# Altium schematic sheet Schematic.SchDoc
size A4
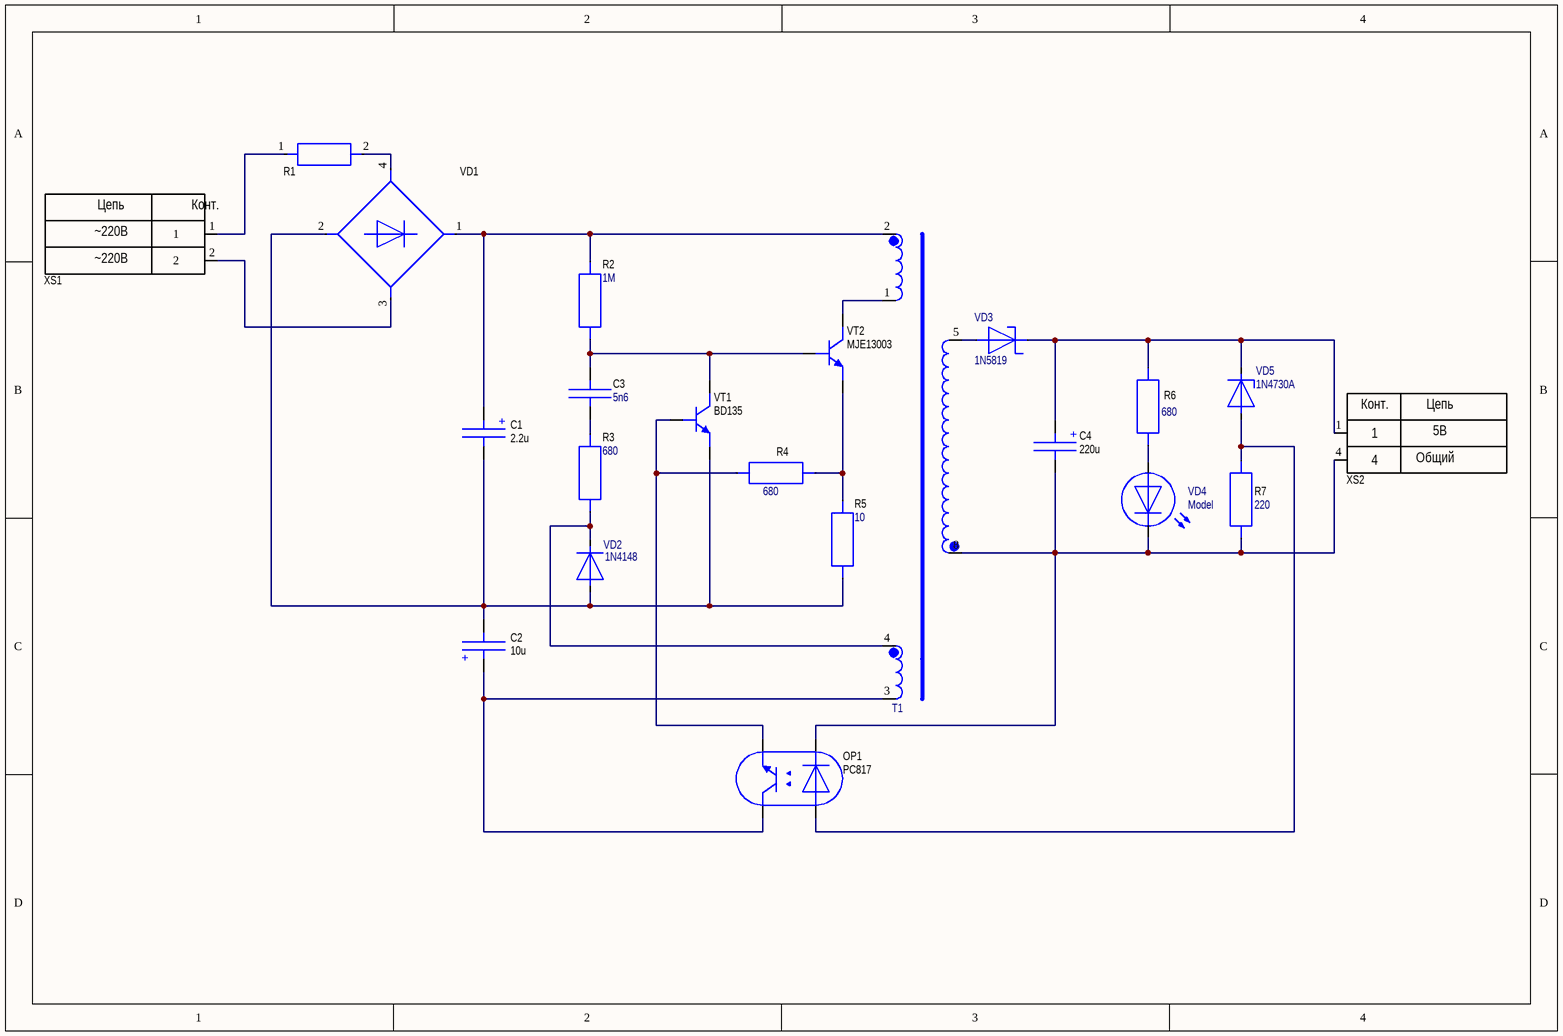
[diagram p0: Schematic.SchDoc]

## Parts
C1  2.2u  [ECAP: 10x12]
C2  10u  [ECAP: 10x20]
C3  5n6  [CAP: 3x4]
C4  220u  [ECAP: 6x11]
OP1  PC817  [DIP-4]
R1  RES 2W_1Ohm  [RES: 0.5W]  (value not drawn)
R2  1M  [RES: 0.25W]
R3  680  [RES: 0.25W]
R4  680  [RES: 0.25W]
R5  10  [RES: 0.25W]
R6  680  [RES: 0.25W]
R7  220  [RES: 0.25W]
T1  200x15x7  [TSD-0816]  (value not drawn)
VD1  DB106  [DFM]  (value not drawn)
VD2  1N4148  [DO-35]
VD3  1N5819  [DO-41]
VD4  Model  [LED: RED]
VD5  1N4730A  [DO-41]
VT1  BD135  [TO-126 / SOT-32]
VT2  MJE13003  [TO-126 / SOT-32]
XS1  306-021-12  [KLS2-306-021-12 - duplicate]  (value not drawn)
XS2  USB 2.0  [USB 2.0]  (value not drawn)

## Nets
NetC1_1: C1.1 R2.2 T1.2 VD1.1
NetC1_2: C1.2 C2.2 R5.2 VD1.2 VD2.1 VT1.3(E)
NetC2_1: C2.1 OP1.4 T1.3
NetC3_1: C3.1 R3.2
NetC3_2: C3.2 R2.1 VT1.2(C) VT2.1(B)
NetC4_1: C4.1 R6.2 VD3.2 VD5.2 XS2.1
NetC4_2: C4.2 OP1.2(Cathode) R7.1 T1.8 VD4.2 XS2.4
NetOP1_1: OP1.1(Anode) R7.2 VD5.1
NetOP1_3: OP1.3 R4.2 VT1.1(B)
NetR1_1: R1.1 XS1.1
NetR1_2: R1.2 VD1.4
NetR3_1: R3.1 T1.4 VD2.2
NetR4_1: R4.1 R5.1 VT2.3(E)
NetR6_1: R6.1 VD4.1
NetT1_1: T1.1 VT2.2(C)
NetT1_5: T1.5 VD3.1
NetVD1_3: VD1.3 XS1.2

## Notes on the sheet
- (in symbol 306-021-12) Цепь; Конт.; ~220B
- (in symbol ECAP: 2.2u_400v) +
- (in symbol ECAP: 10u_400v) +
- (in symbol ECAP: 220u_10v) +
- (in symbol USB 2.0) Конт.; Цепь; 5B; Общий

## Library data of the parts
C1 = ECAP: 2.2u_400v: ComponentLink1Description: market; ComponentLink1URL: https://www.chipdip.ru/product0/708508021; ComponentLink2Description: datasheet; ComponentLink2URL: https://static.chipdip.ru/lib/235/DOC000235479.pdf
C2 = ECAP: 10u_400v: ComponentLink1Description: market; ComponentLink1URL: https://www.chipdip.ru/product0/22832; ComponentLink2Description: datasheet; ComponentLink2URL: https://static.chipdip.ru/lib/235/DOC000235479.pdf
C3 = CAP: 56P: ComponentLink1Description: market; ComponentLink1URL: https://www.chipdip.ru/product0/48477; ComponentLink2Description: datasheet; ComponentLink2URL: https://static.chipdip.ru/lib/056/DOC000056282.pdf
C4 = ECAP: 220u_10v: ComponentLink1Description: market; ComponentLink1URL: https://www.chipdip.ru/product0/9000274034; ComponentLink2Description: datasheet; ComponentLink2URL: https://static.chipdip.ru/lib/235/DOC000235479.pdf
R1 = RES 0.5W: ComponentLink1Description: market; ComponentLink1URL: https://www.chipdip.ru/product0/24035; ComponentLink2Description: datasheet; ComponentLink2URL: https://static.chipdip.ru/lib/055/DOC000055622.pdf
R2-R7 = RES 0.25W: ComponentLink1Description: market; ComponentLink1URL: https://www.chipdip.ru/product0/51741; ComponentLink2Description: datasheet; ComponentLink2URL: https://static.chipdip.ru/lib/056/DOC000056035.pdf
T1 = TRANSFORM
VD4 = LED:RED: ComponentLink1Description: market; ComponentLink1URL: https://www.chipdip.ru/product/gnl-3012hd; ComponentLink2Description: datasheet; ComponentLink2URL: https://static.chipdip.ru/lib/773/DOC002773602.pdf
OP1 = PC817: ComponentLink1Description: market; ComponentLink1URL: https://www.chipdip.ru/product/fod817b; ComponentLink2Description: datasheet; ComponentLink2URL: https://static.chipdip.ru/lib/297/DOC000297284.pdf
VD1 = DB106: ComponentLink1Description: market; ComponentLink1URL: https://www.chipdip.ru/product/df08m; ComponentLink2Description: datasheet; ComponentLink2URL: https://static.chipdip.ru/lib/151/DOC000151037.pdf
VT1 = BD135: ComponentLink1Description: market; ComponentLink1URL: https://www.chipdip.ru/product/bd135; ComponentLink2Description: datasheet; ComponentLink2URL: https://static.chipdip.ru/lib/011/DOC001011692.pdf
VT2 = MJE13003: ComponentLink1Description: market; ComponentLink1URL: https://www.chipdip.ru/product/mje13003-st13003; ComponentLink3Description: datasheet; ComponentLink3URL: https://static.chipdip.ru/lib/204/DOC000204730.pdf
XS1 = 306-021-12: ComponentLink1Description: market; ComponentLink1URL: https://www.chipdip.ru/product/306-021-12; ComponentLink2Description: datasheet; ComponentLink2URL: https://static.chipdip.ru/lib/064/DOC000064100.pdf
XS2 = USB 2.0: ComponentLink1Description: market; ComponentLink1URL: https://yandex.ru/search/?clid=2285101&text=USBA-1J%20%D1%83%D0%B3%D0%BE%20%D0%B3%D0%BE%D1%81%D1%82&lr=213; ComponentLink2Description: datasheet; ComponentLink2URL: https://static.chipdip.ru/lib/063/DOC000063868.pdf